# EAGLE schematic schema (EAGLE 9.7.0)
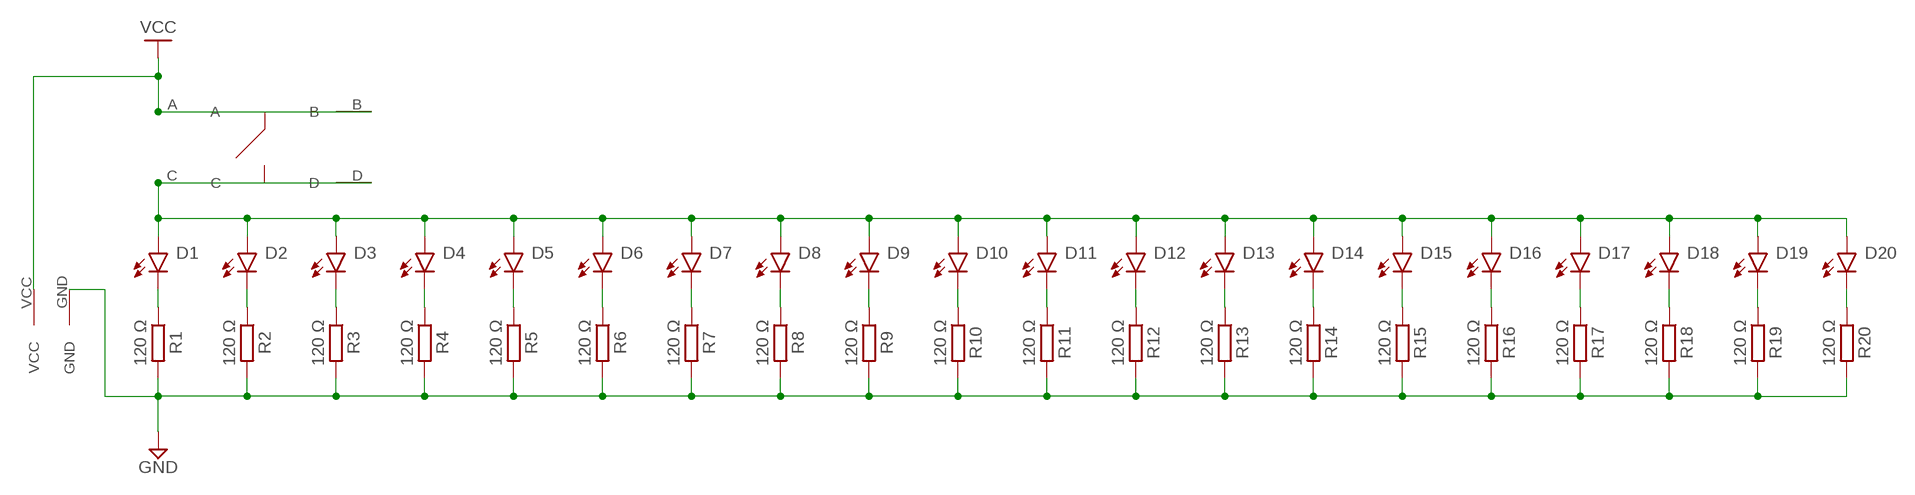
[diagram p0: schematic, sheet 1]

## Parts
D1  LED  CHIP-FLAT-Y_0805  [LEDC2012X110N_FLAT-Y]
D2  LED  CHIP-FLAT-Y_0805  [LEDC2012X110N_FLAT-Y]
D3  LED  CHIP-FLAT-Y_0805  [LEDC2012X110N_FLAT-Y]
D4  LED  CHIP-FLAT-Y_0805  [LEDC2012X110N_FLAT-Y]
D5  LED  CHIP-FLAT-Y_0805  [LEDC2012X110N_FLAT-Y]
D6  LED  CHIP-FLAT-Y_0805  [LEDC2012X110N_FLAT-Y]
D7  LED  CHIP-FLAT-Y_0805  [LEDC2012X110N_FLAT-Y]
D8  LED  CHIP-FLAT-Y_0805  [LEDC2012X110N_FLAT-Y]
D9  LED  CHIP-FLAT-Y_0805  [LEDC2012X110N_FLAT-Y]
D10  LED  CHIP-FLAT-Y_0805  [LEDC2012X110N_FLAT-Y]
D11  LED  CHIP-FLAT-Y_0805  [LEDC2012X110N_FLAT-Y]
D12  LED  CHIP-FLAT-Y_0805  [LEDC2012X110N_FLAT-Y]
D13  LED  CHIP-FLAT-Y_0805  [LEDC2012X110N_FLAT-Y]
D14  LED  CHIP-FLAT-Y_0805  [LEDC2012X110N_FLAT-Y]
D15  LED  CHIP-FLAT-Y_0805  [LEDC2012X110N_FLAT-Y]
D16  LED  CHIP-FLAT-Y_0805  [LEDC2012X110N_FLAT-Y]
D17  LED  CHIP-FLAT-Y_0805  [LEDC2012X110N_FLAT-Y]
D18  LED  CHIP-FLAT-Y_0805  [LEDC2012X110N_FLAT-Y]
D19  LED  CHIP-FLAT-Y_0805  [LEDC2012X110N_FLAT-Y]
D20  LED  CHIP-FLAT-Y_0805  [LEDC2012X110N_FLAT-Y]
R1  120 Ω  R_CHIP-0603(1608-METRIC)  [RESC1608X60]
R2  120 Ω  R_CHIP-0603(1608-METRIC)  [RESC1608X60]
R3  120 Ω  R_CHIP-0603(1608-METRIC)  [RESC1608X60]
R4  120 Ω  R_CHIP-0603(1608-METRIC)  [RESC1608X60]
R5  120 Ω  R_CHIP-0603(1608-METRIC)  [RESC1608X60]
R6  120 Ω  R_CHIP-0603(1608-METRIC)  [RESC1608X60]
R7  120 Ω  R_CHIP-0603(1608-METRIC)  [RESC1608X60]
R8  120 Ω  R_CHIP-0603(1608-METRIC)  [RESC1608X60]
R9  120 Ω  R_CHIP-0603(1608-METRIC)  [RESC1608X60]
R10  120 Ω  R_CHIP-0603(1608-METRIC)  [RESC1608X60]
R11  120 Ω  R_CHIP-0603(1608-METRIC)  [RESC1608X60]
R12  120 Ω  R_CHIP-0603(1608-METRIC)  [RESC1608X60]
R13  120 Ω  R_CHIP-0603(1608-METRIC)  [RESC1608X60]
R14  120 Ω  R_CHIP-0603(1608-METRIC)  [RESC1608X60]
R15  120 Ω  R_CHIP-0603(1608-METRIC)  [RESC1608X60]
R16  120 Ω  R_CHIP-0603(1608-METRIC)  [RESC1608X60]
R17  120 Ω  R_CHIP-0603(1608-METRIC)  [RESC1608X60]
R18  120 Ω  R_CHIP-0603(1608-METRIC)  [RESC1608X60]
R19  120 Ω  R_CHIP-0603(1608-METRIC)  [RESC1608X60]
R20  120 Ω  R_CHIP-0603(1608-METRIC)  [RESC1608X60]
SW1  6X6MM_THT_TACTILE_SWITCH  [6X6MM_THT_TACTILE_SWITCH]
U$1  POWER_PADS  [POWER_PADS]

## Nets
GND: R1.2 R2.2 R3.2 R4.2 R5.2 R6.2 R7.2 R8.2 R9.2 R10.2 R11.2 R12.2 R13.2 R14.2 R15.2 R16.2 R17.2 R18.2 R19.2 R20.2 U$1.GND
N$1: D1.C R1.1
N$5: D2.C R2.1
N$7: D3.C R3.1
N$9: D4.C R4.1
N$11: D5.C R5.1
N$13: D6.C R6.1
N$14: D1.A D2.A D3.A D4.A D5.A D6.A D7.A D8.A D9.A D10.A D11.A D12.A D13.A D14.A D15.A D16.A D17.A D18.A D19.A D20.A SW1.C SW1.D
N$15: D7.C R7.1
N$17: D8.C R8.1
N$19: D9.C R9.1
N$21: D10.C R10.1
N$23: D11.C R11.1
N$25: D12.C R12.1
N$27: D13.C R13.1
N$29: D14.C R14.1
N$31: D15.C R15.1
N$33: D16.C R16.1
N$35: D17.C R17.1
N$37: D18.C R18.1
N$39: D19.C R19.1
N$41: D20.C R20.1
VCC: SW1.A SW1.B U$1.VCC

## Library data of the parts
D1-D20 = copy-of-leds:CHIP-FLAT-Y; CATEGORY: LED; COLOR: YELLOW; DESCRIPTION: CHIP LED FLAT; SUB-CATEGORY: CHIP; TYPE: FLAT_TOP; VALUE: LED_YELLOW
R1-R20 = copy-of-resistors:R: Resistor Fixed - Generic; CATEGORY: Resistor; SUB-CATEGORY: Fixed
SW1 = 6x6mm_THT_TACTILE_SWITCH:6X6MM_THT_TACTILE_SWITCH
U$1 = POWER_PADS:POWER_PADS